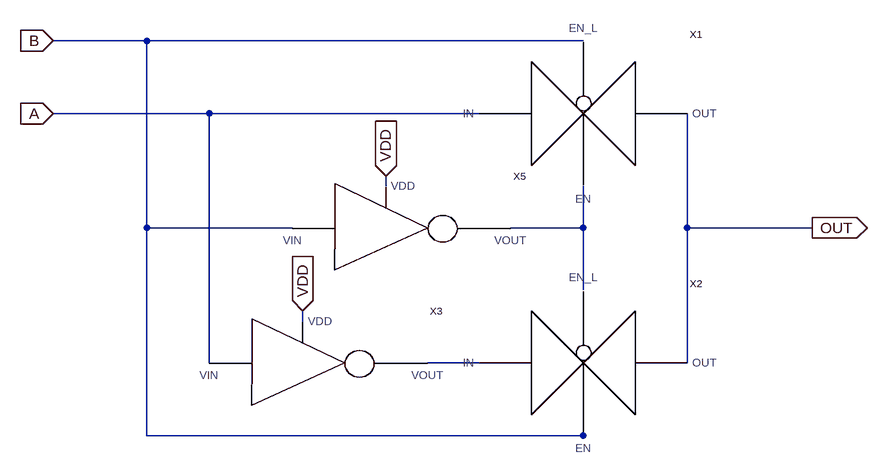
[diagram p0: schematic xor.asc]
xor.asc, the LTspice schematic file:
Version 4
SHEET 1 880 680
WIRE -672 -192 -816 -192
WIRE 0 -192 -672 -192
WIRE -576 -80 -816 -80
WIRE -160 -80 -576 -80
WIRE -304 32 -304 16
WIRE -672 96 -672 -192
WIRE -448 96 -672 96
WIRE 0 96 0 32
WIRE 0 96 -112 96
WIRE 160 96 160 -80
WIRE 352 96 160 96
WIRE 0 192 0 96
WIRE -432 240 -432 224
WIRE -576 304 -576 -80
WIRE -160 304 -240 304
WIRE 160 304 160 96
WIRE -672 416 -672 96
WIRE 0 416 0 368
WIRE 0 416 -672 416
FLAG -816 -80 A
IOPIN -816 -80 In
FLAG -816 -192 B
IOPIN -816 -192 In
FLAG 352 96 OUT
IOPIN 352 96 Out
FLAG -304 16 VDD
IOPIN -304 16 In
FLAG -432 224 VDD
IOPIN -432 224 In
SYMBOL inverter -320 96 R0
SYMATTR InstName X5
SYMBOL inverter -448 304 R0
SYMATTR InstName X3
SYMBOL tg 0 -80 R0
SYMATTR InstName X1
SYMBOL tg 0 304 R0
SYMATTR InstName X2

The netlist it stands for:
* xor.asc
XX5 B N001 VDD inverter  ; pins VIN VOUT VDD
XX3 A N002 VDD inverter  ; pins VIN VOUT VDD
XX1 A OUT B N001 tg  ; pins IN OUT EN_L EN
XX2 N002 OUT N001 B tg  ; pins IN OUT EN_L EN
.backanno
.end